# EAGLE schematic unipolar (EAGLE 8.2.2)
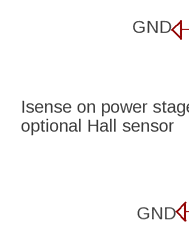
[diagram p0: schematic, sheet 1, part 1 of 2]
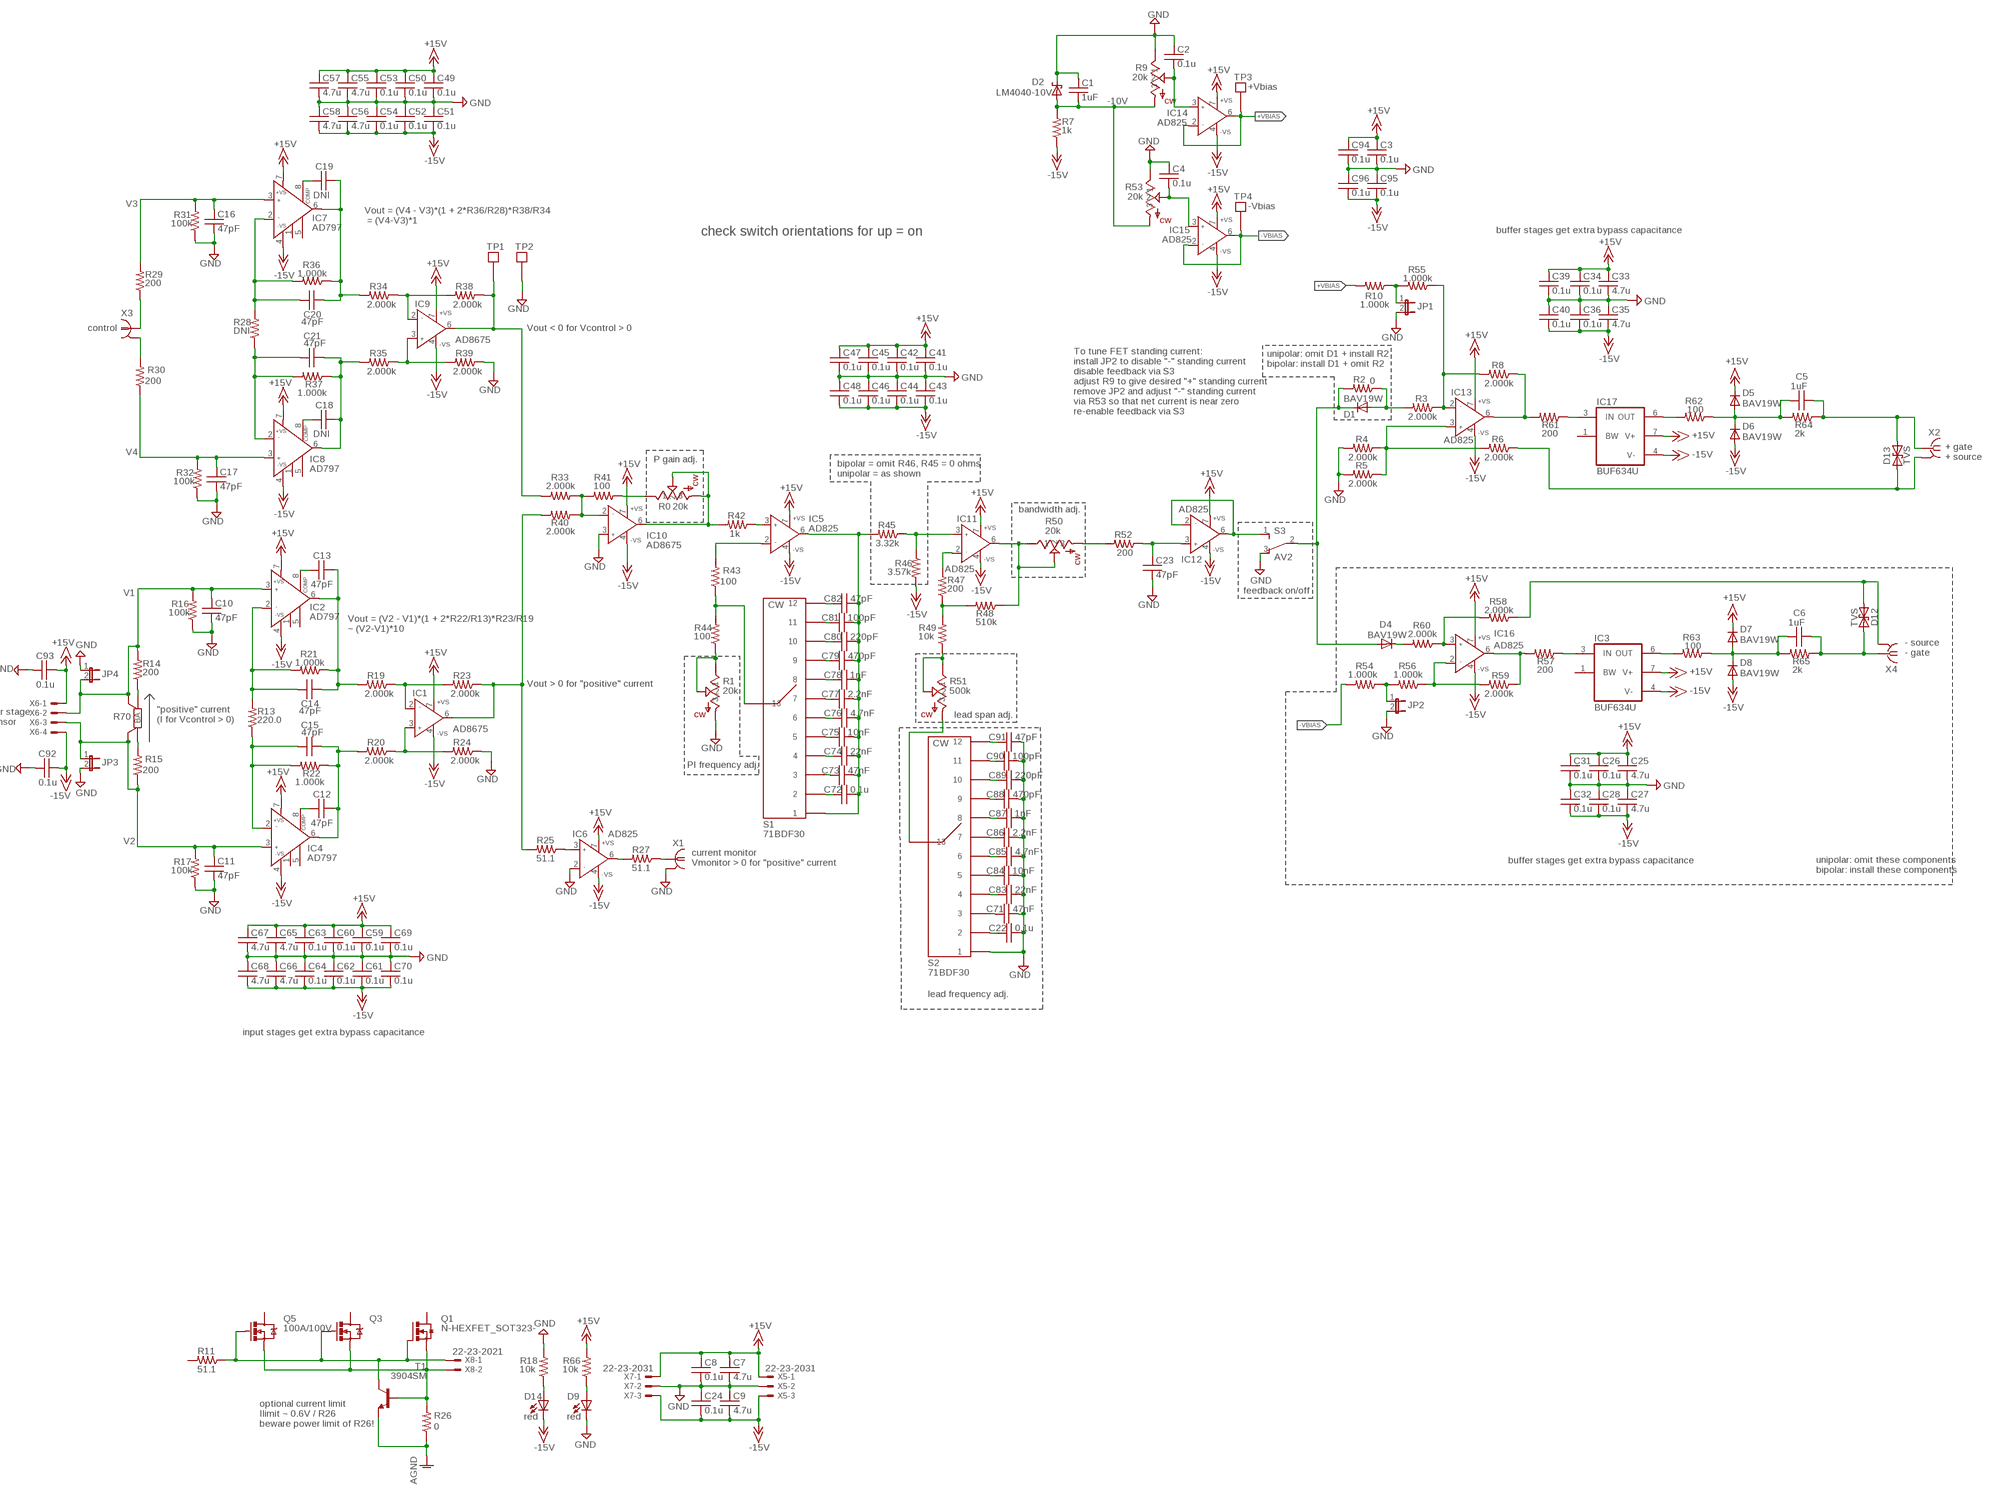
[diagram p1: schematic, sheet 1, part 2 of 2]

## Parts
C1  1uF  C0603  [0603]
C2  0.1u  C0603  [0603]
C3  0.1u  C0603  [0603]
C4  0.1u  C0603  [0603]
C5  1uF  C0603  [0603]
C6  1uF  C0603  [0603]
C7  4.7u  C0603  [0603]
C8  0.1u  C0603  [0603]
C9  4.7u  C0603  [0603]
C10  47pF  C0603  [0603]
C11  47pF  C0603  [0603]
C12  47pF  C0603  [0603]
C13  47pF  C0603  [0603]
C14  47pF  C0603  [0603]
C15  47pF  C0603  [0603]
C16  47pF  C0603  [0603]
C17  47pF  C0603  [0603]
C18  DNI  C0603  [0603]
C19  DNI  C0603  [0603]
C20  47pF  C0603  [0603]
C21  47pF  C0603  [0603]
C22  0.1u  C0603  [0603]
C23  47pF  C0603  [0603]
C24  0.1u  C0603  [0603]
C25  4.7u  C0603  [0603]
C26  0.1u  C0603  [0603]
C27  4.7u  C0603  [0603]
C28  0.1u  C0603  [0603]
C31  0.1u  C0603  [0603]
C32  0.1u  C0603  [0603]
C33  4.7u  C0603  [0603]
C34  0.1u  C0603  [0603]
C35  4.7u  C0603  [0603]
C36  0.1u  C0603  [0603]
C39  0.1u  C0603  [0603]
C40  0.1u  C0603  [0603]
C41  0.1u  C0603  [0603]
C42  0.1u  C0603  [0603]
C43  0.1u  C0603  [0603]
C44  0.1u  C0603  [0603]
C45  0.1u  C0603  [0603]
C46  0.1u  C0603  [0603]
C47  0.1u  C0603  [0603]
C48  0.1u  C0603  [0603]
C49  0.1u  C0603  [0603]
C50  0.1u  C0603  [0603]
C51  0.1u  C0603  [0603]
C52  0.1u  C0603  [0603]
C53  0.1u  C0603  [0603]
C54  0.1u  C0603  [0603]
C55  4.7u  C0603  [0603]
C56  4.7u  C0603  [0603]
C57  4.7u  C0603  [0603]
C58  4.7u  C0603  [0603]
C59  0.1u  C0603  [0603]
C60  0.1u  C0603  [0603]
C61  0.1u  C0603  [0603]
C62  0.1u  C0603  [0603]
C63  0.1u  C0603  [0603]
C64  0.1u  C0603  [0603]
C65  4.7u  C0603  [0603]
C66  4.7u  C0603  [0603]
C67  4.7u  C0603  [0603]
C68  4.7u  C0603  [0603]
C69  0.1u  C0603  [0603]
C70  0.1u  C0603  [0603]
C71  47nF  C0603  [0603]
C72  0.1u  C0603  [0603]
C73  47nF  C0603  [0603]
C74  22nF  C0603  [0603]
C75  10nF  C0603  [0603]
C76  4.7nF  C0603  [0603]
C77  2.2nF  C0603  [0603]
C78  1nF  C0603  [0603]
C79  470pF  C0603  [0603]
C80  220pF  C0603  [0603]
C81  100pF  C0603  [0603]
C82  47pF  C0603  [0603]
C83  22nF  C0603  [0603]
C84  10nF  C0603  [0603]
C85  4.7nF  C0603  [0603]
C86  2.2nF  C0603  [0603]
C87  1nF  C0603  [0603]
C88  470pF  C0603  [0603]
C89  220pF  C0603  [0603]
C90  100pF  C0603  [0603]
C91  47pF  C0603  [0603]
C92  0.1u  C0603  [0603]
C93  0.1u  C0603  [0603]
C94  0.1u  C0603  [0603]
C95  0.1u  C0603  [0603]
C96  0.1u  C0603  [0603]
D1  BAV19W  DIODE-SOD123  [SOD123]
D2  LM4040-10V  LM4040  [SOT23]
D4  BAV19W  DIODE-SOD123  [SOD123]
D5  BAV19W  DIODE-SOD123  [SOD123]
D6  BAV19W  DIODE-SOD123  [SOD123]
D7  BAV19W  DIODE-SOD123  [SOD123]
D8  BAV19W  DIODE-SOD123  [SOD123]
D9  red  LED0603  [LED0603]
D12  TVS  [SMA-DIODE]
D13  TVS  [SMA-DIODE]
D14  red  LED0603  [LED0603]
IC1  AD8675  AD825_BR  [SO8]
IC2  AD797  AD797_AR  [SO8]
IC3  BUF634U  [SO08]
IC4  AD797  AD797_BR  [SO8]
IC5  AD825  AD825_A  [SO08]
IC6  AD825  AD825_A  [SO08]
IC7  AD797  AD797_AR  [SO8]
IC8  AD797  AD797_BR  [SO8]
IC9  AD8675  AD825_BR  [SO8]
IC10  AD8675  AD825_BR  [SO8]
IC11  AD825  AD825_A  [SO08]
IC12  AD825  AD825_BR  [SO8]
IC13  AD825  AD825_BR  [SO8]
IC14  AD825  AD825_A  [SO08]
IC15  AD825  AD825_A  [SO08]
IC16  AD825  AD825_A  [SO08]
IC17  BUF634U  [SO08]
JP1  JP1E  [JP1]
JP2  JP1E  [JP1]
JP3  JP1E  [JP1]
JP4  JP1E  [JP1]
Q1  N-HEXFET_SOT323-  [SOT223]
Q3  MOSFET-NCHANNELFDD8780  [DPAK]
Q5  100A/100V  MOSFET-NCHANNELPSMN7R0  [TO-263/D2PAK]
R0  20k  POT  [3590]
R1  20k  TRIM_US-B90P  [SP19L]
R2  0  R0603  [0603]
R3  2.000k  R0603  [0603]
R4  2.000k  R0603  [0603]
R5  2.000k  R0603  [0603]
R6  2.000k  R0603  [0603]
R7  1k  R0603  [0603]
R8  2.000k  R0603  [0603]
R9  20k  TRIM_US-B90P  [SP19L]
R10  1.000k  R0603  [0603]
R11  51.1  R0603  [0603]
R13  220.0  R0603  [0603]
R14  200  R0603  [0603]
R15  200  R0603  [0603]
R16  100k  R0603  [0603]
R17  100k  R0603  [0603]
R18  10k  R0603  [0603]
R19  2.000k  R0603  [0603]
R20  2.000k  R0603  [0603]
R21  1.000k  R0603  [0603]
R22  1.000k  R0603  [0603]
R23  2.000k  R0603  [0603]
R24  2.000k  R0603  [0603]
R25  51.1  R0603  [0603]
R26  0  RESISTOR2512  [2512]
R27  51.1  R0603  [0603]
R28  DNI  R0603  [0603]
R29  200  R0603  [0603]
R30  200  R0603  [0603]
R31  100k  R0603  [0603]
R32  100k  R0603  [0603]
R33  2.000k  R0603  [0603]
R34  2.000k  R0603  [0603]
R35  2.000k  R0603  [0603]
R36  1.000k  R0603  [0603]
R37  1.000k  R0603  [0603]
R38  2.000k  R0603  [0603]
R39  2.000k  R0603  [0603]
R40  2.000k  R0603  [0603]
R41  100  R0603  [0603]
R42  1k  R0603  [0603]
R43  100  R0603  [0603]
R44  100  R0603  [0603]
R45  3.32k  R0603  [0603]
R46  3.57k  R0603  [0603]
R47  200  R0603  [0603]
R48  510k  R0603  [0603]
R49  10k  R0603  [0603]
R50  20k  TRIM_US-B90P  [SP19L]
R51  500k  TRIM_US-B90P  [SP19L]
R52  200  R0603  [0603]
R53  20k  TRIM_US-B90P  [SP19L]
R54  1.000k  R0603  [0603]
R55  1.000k  R0603  [0603]
R56  1.000k  R0603  [0603]
R57  200  R0603  [0603]
R58  2.000k  R0603  [0603]
R59  2.000k  R0603  [0603]
R60  2.000k  R0603  [0603]
R61  200  R0603  [0603]
R62  100  R0603  [0603]
R63  100  R0603  [0603]
R64  2k  R0603  [0603]
R65  2k  R0603  [0603]
R66  10k  R0603  [0603]
R70  RSENSE  [22-23-2041]
S1  71BDF30  [71BDF]
S2  71BDF30  [71BDF]
S3  AV2  SPDT  [SPDT-AV2]
T1  3904SM  [SOT23]
TP1  TESTPOINT  [TESTPOINT]
TP2  TESTPOINT  [TESTPOINT]
TP3  TESTPOINT  [TESTPOINT]
TP4  TESTPOINT  [TESTPOINT]
X1  1-227161-0  [AMP_227161]
X2  BU-SMA-H  [BU-SMA-H]
X3  1-227161-0  [AMP_227161]
X4  BU-SMA-H  [BU-SMA-H]
X5  22-23-2031  [22-23-2031]
X6  22-23-2041  [22-23-2041]
X7  22-23-2031  [22-23-2031]
X8  22-23-2021  [22-23-2021]

## Nets
+15V: C3.1 C7.1 C8.1 C25.1 C26.1 C31.1 C33.1 C34.1 C39.1 C41.1 C42.1 C45.1 C47.1 C49.1 C50.1 C53.1 C55.1 C57.1 C59.1 C60.1 C63.1 C65.1 C67.1 C69.1 C93.2 C94.1 D5.C D7.C IC1.7(+VS) IC2.7(+VS) IC3.7(V+) IC4.7(+VS) IC5.7(+VS) IC6.7(+VS) IC7.7(+VS) IC8.7(+VS) IC9.7(+VS) IC10.7(+VS) IC11.7(+VS) IC12.7(+VS) IC13.7(+VS) IC14.7(+VS) IC15.7(+VS) IC16.7(+VS) IC17.7(V+) R66.2 X5.1 X6.1 X7.1
+GATE: C5.2 D13.C R64.1 X2.1
+SOURCE: D13.A R6.1 X2.2 X2.3 X2.4 X2.5
+VBIAS: IC14.2(IN-) IC14.6(OUT) R10.2 TP3.P$1
-10V: C1.2 D2.2(A) R7.2 R9.E R53.E
-15V: C9.2 C24.2 C27.2 C28.2 C32.2 C35.2 C36.2 C40.2 C43.2 C44.2 C46.2 C48.2 C51.2 C52.2 C54.2 C56.2 C58.2 C61.2 C62.2 C64.2 C66.2 C68.2 C70.2 C92.2 C95.2 C96.2 D6.A D8.A D14.C IC1.4(-VS) IC2.4(-VS) IC3.4(V-) IC4.4(-VS) IC5.4(-VS) IC6.4(-VS) IC7.4(-VS) IC8.4(-VS) IC9.4(-VS) IC10.4(-VS) IC11.4(-VS) IC12.4(-VS) IC13.4(-VS) IC14.4(-VS) IC15.4(-VS) IC16.4(-VS) IC17.4(V-) R7.1 R46.2 X5.3 X6.4 X7.3
-GATE: C6.2 D12.C R65.1 X4.1
-SOURCE: D12.A R58.1 X4.2 X4.3 X4.4 X4.5
-VBIAS: IC15.2(IN-) IC15.6(OUT) R54.2 TP4.P$1
AGND: R26.1 T1.2(E)
GND: C1.1 C2.1 C3.2 C4.1 C7.2 C8.2 C9.1 C10.2 C11.2 C16.2 C17.2 C22.2 C23.2 C24.1 C25.2 C26.2 C27.1 C28.1 C31.2 C32.1 C33.2 C34.2 C35.1 C36.1 C39.2 C40.1 C41.2 C42.2 C43.1 C44.1 C45.2 C46.1 C47.2 C48.1 C49.2 C50.2 C51.1 C52.1 C53.2 C54.1 C55.2 C56.1 C57.2 C58.1 C59.2 C60.2 C61.1 C62.1 C63.2 C64.1 C65.2 C66.1 C67.2 C68.1 C69.2 C70.1 C71.2 C83.2 C84.2 C85.2 C86.2 C87.2 C88.2 C89.2 C90.2 C91.2 C92.1 C93.1 C94.2 C95.1 C96.1 D2.1(C) D9.C IC6.2(IN-) IC10.3(IN+) JP1.2 JP2.2 JP3.2 JP4.1 R1.E R4.2 R5.2 R9.A R16.1 R17.1 R18.2 R24.1 R31.1 R32.1 R39.1 R53.A S2.1 S3.3 TP2.P$1 X1.2 X5.2 X7.2
N$1: R1.A R1.S R44.1
N$2: D1.A R2.1 R3.2
N$3: JP1.1 R10.1 R55.2
N$4: D4.C R60.2
N$5: IC13.3(IN+) R4.1 R5.1 R6.2
N$6: Q1.1(G) Q3.1(G) Q5.1(G) R11.1 T1.3(C) X8.1
N$7: C14.1 IC2.2(IN-) R13.2 R21.2
N$8: R14.1 R70.1(A)
N$9: IC13.2(IN-) R3.1 R8.2 R55.1
N$10: Q1.3(S) Q3.3(S) Q5.3(S) R26.2 T1.1(B) X8.2
N$12: C2.2 IC14.3(IN+) R9.S
N$13: R15.2 R70.4(B)
N$15: C15.1 IC4.2(IN-) R13.1 R22.2
N$16: C12.1 IC4.8(COMP)
N$17: C12.2 C15.2 IC4.6(OUT) R20.2 R22.1
N$18: C13.1 IC2.8(COMP)
N$19: C13.2 C14.2 IC2.6(OUT) R19.2 R21.1
N$20: IC1.2(IN-) R19.1 R23.2
N$21: IC1.3(IN+) R20.1 R24.2
N$22: IC1.6(OUT) R23.1 R25.2 R40.2
N$23: IC6.3(IN+) R25.1
N$24: IC6.6(OUT) R27.2
N$25: R27.1 X1.1
N$26: C20.1 IC7.2(IN-) R28.2 R36.2
N$27: C16.1 IC7.3(IN+) R29.2 R31.2
N$28: C17.1 IC8.3(IN+) R30.1 R32.2
N$29: R29.1 X3.1
N$30: R30.2 X3.2
N$31: C21.1 IC8.2(IN-) R28.1 R37.2
N$32: C18.1 IC8.8(COMP)
N$33: C18.2 C21.2 IC8.6(OUT) R35.2 R37.1
N$34: C19.1 IC7.8(COMP)
N$35: C19.2 C20.2 IC7.6(OUT) R34.2 R36.1
N$36: IC9.2(IN-) R34.1 R38.2
N$37: IC9.3(IN+) R35.1 R39.2
N$38: IC9.6(OUT) R33.2 R38.1 TP1.P$1
N$39: IC10.2(IN-) R33.1 R40.1 R41.2
N$40: IC11.3(IN+) R45.1 R46.1
N$41: IC10.6(OUT) R0.2 R0.3 R42.2
N$42: IC5.3(IN+) R42.1
N$43: IC5.2(IN-) R43.2
N$44: R43.1 R44.2 S1.13
N$45: R51.E S2.13
N$46: IC11.2(IN-) R47.2
N$47: R47.1 R48.2 R49.2
N$48: IC11.6(OUT) R48.1 R50.A R50.S
N$50: R49.1 R51.A R51.S
N$51: R50.E R52.2
N$52: C23.1 IC12.3(IN+) R52.1
N$53: IC12.2(IN-) IC12.6(OUT) S3.1
N$54: D1.C D4.A R2.2 S3.2
N$57: C4.2 IC15.3(IN+) R53.S
N$59: JP2.1 R54.1 R56.2
N$60: IC16.2(IN-) R56.1 R59.2
N$61: IC16.3(IN+) R58.2 R60.1
N$62: IC16.6(OUT) R57.2 R59.1
N$63: D9.A R66.1
N$64: IC3.3(IN) R57.1
N$65: IC17.3(IN) R61.1
N$66: IC13.6(OUT) R8.1 R61.2
N$68: IC17.6(OUT) R62.2
N$69: IC3.6(OUT) R63.2
N$70: C5.1 D5.A D6.C R62.1 R64.2
N$73: C6.1 D7.A D8.C R63.1 R65.2
N$77: D14.A R18.1
N$78: C72.2 C73.2 C74.2 C75.2 C76.2 C77.2 C78.2 C79.2 C80.2 C81.2 C82.2 IC5.6(OUT) R45.2 S1.1
N$79: C72.1 S1.2
N$80: C73.1 S1.3
N$81: C74.1 S1.4
N$82: R0.1 R41.1
N$83: C75.1 S1.5
N$84: C76.1 S1.6
N$85: C77.1 S1.7
N$86: C78.1 S1.8
N$87: C79.1 S1.9
N$88: C80.1 S1.10
N$89: C81.1 S1.11
N$90: C82.1 S1.12
N$91: C22.1 S2.2
N$92: C71.1 S2.3
N$93: C83.1 S2.4
N$94: C84.1 S2.5
N$95: C85.1 S2.6
N$96: C86.1 S2.7
N$97: C87.1 S2.8
N$98: C88.1 S2.9
N$99: C89.1 S2.10
N$100: C90.1 S2.11
N$101: C91.1 S2.12
V+: C11.1 IC4.3(IN+) JP3.1 R15.1 R17.2 R70.3(SB) X6.3
V-: C10.1 IC2.3(IN+) JP4.2 R14.2 R16.2 R70.2(SA) X6.2
Unconnected: IC2.1(OFF) IC2.5(OFF) IC3.1(BW) IC4.1(OFF) IC4.5(OFF) IC7.1(OFF) IC7.5(OFF) IC8.1(OFF) IC8.5(OFF) IC17.1(BW) Q1.4(D) Q3.4(D) Q5.2(D) R11.2

## Notes on the sheet
- +Vbias
- -10V
- V3 | -Vbias
- Vout = (V4 - V3)*(1 + 2*R36/R28)*R38/R34 
   = (V4-V3)*1
- check switch orientations for up = on | buffer stages get extra bypass capacitance
- control | Vout < 0 for Vcontrol > 0
- unipolar: omit D1 + install R2
  bipolar: install D1 + omit R2
- To tune FET standing current:
  install JP2 to disable "-" standing current
  disable feedback via S3
  adjust R9 to give desired "+" standing current
  remove JP2 and adjust "-" standing current 
  via R53 so that net current is near zero
  re-enable feedback via S3
- V4
- + gate
  + source
- P gain adj.
- bipolar = omit R46, R45 = 0 ohms
  unipolar = as shown
- bandwidth adj.
- V1 | feedback on/off
- Vout = (V2 - V1)*(1 + 2*R22/R13)*R23/R19 
  ~ (V2-V1)*10
- - source
  - gate
- Vout > 0 for "positive" current
- lead span adj.
- "positive" current 
  (I for Vcontrol > 0)
- Isense on power stage
  optional Hall sensor
- PI frequency adj.
- V2
- buffer stages get extra bypass capacitance
- current monitor
  Vmonitor > 0 for "positive" current
- unipolar: omit these components
  bipolar: install these components
- lead frequency adj.
- input stages get extra bypass capacitance
- optional current limit
  Ilimit ~ 0.6V / R26
  beware power limit of R26!

## Library data of the parts
C1-C28 C31-C36 C39-C96 = acrooptics:C: Capacitor
D1 D4-D8 = AquariumLibrary:DIODE-: DIODE
D2 = noah:LM4040: LM4040 Reference Zener Diode
D9 D14 = acrooptics:LED: LED OSRAM: - CHIPLED LG R971, LG N971, LY N971, LG Q971, LY Q971, LO R971, LY R971 LH N974, LH R974 LS Q976, LO Q976, LY Q976 LO Q996 - Hyper CHIPLED LW Q18S LB Q993, LB Q99A, LB R99A - SideLED LS A670, LO A670, LY A670, LG A670, LP A670 LB A673, LV A673, LT A673, LW A673 LH A674 LY A675 LS A676, LA A676, LO A676, LY A676, LW A676 LS A679, LY A679, LG A679 - Hyper Micro SIDELED® LS Y876, LA Y876, LO Y876, LY Y876 LT Y87S - SmartLED LW L88C, LW L88S LB L89C, LB L89S, LG L890 LS L89K, LO L89K, LY L89K LS L896, LA L896, LO L896, LY L896 - TOPLED LS T670, LO T670, LY T670, LG T670, LP T670 LSG T670, LSP T670, LSY T670, LOP T670, LYG T670 LG T671, LOG T671, LSG T671 LB T673, LV T673, LT T673, LW T673 LH T674 LS T676, LA T676, LO T676, LY T676, LB T676, LH T676, LSB T676, LW T676 LB T67C, LV T67C, LT T67C, LS T67K, LO T67K, LY T67K, LW E67C LS E67B, LA E67B, LO E67B, LY E67B, LB E67C, LV E67C, LT E67C LW T67C LS T679, LY T679, LG T679 LS T770, LO T770, LY T770, LG T770, LP T770 LB T773, LV T773, LT T773, LW T773 LH T774 LS E675, LA E675, LY E675, LS T675 LS T776, LA T776, LO T776, LY T776, LB T776 LHGB T686 LT T68C, LB T68C - Hyper Mini TOPLED® LB M676 - Mini TOPLED Santana® LG M470 LS M47K, LO M47K, LY M47K Source: http://www.osram.convergy.de LUXEON: - LUMILED® LXK2-PW12-R00, LXK2-PW12-S00, LXK2-PW14-U00, LXK2-PW14-V00 LXK2-PM12-R00, LXK2-PM12-S00, LXK2-PM14-U00 LXK2-PE12-Q00, LXK2-PE12-R00, LXK2-PE12-S00, LXK2-PE14-T00, LXK2-PE14-U00 LXK2-PB12-K00, LXK2-PB12-L00, LXK2-PB12-M00, LXK2-PB14-N00, LXK2-PB14-P00, LXK2-PB14-Q00 LXK2-PR12-L00, LXK2-PR12-M00, LXK2-PR14-Q00, LXK2-PR14-R00 LXK2-PD12-Q00, LXK2-PD12-R00, LXK2-PD12-S00 LXK2-PH12-R00, LXK2-PH12-S00 LXK2-PL12-P00, LXK2-PL12-Q00, LXK2-PL12-R00 Source: www.luxeon.com KINGBRIGHT: KA-3528ASYC Source: www.kingbright.com
D12 D13 = SparkFun:TVS
IC1 IC9 IC10 IC12 IC13 = noah:AD825_B: Low Cost, General-Purpose High Speed JFET Amplifier Source: http://www.analog.com/static/imported-files/data_sheets/AD825.pdf; MF: ALTERA CORPORATION; MPN: AD825ARZ; OC_FARNELL: 9603735; OC_NEWARK: 59K6528
IC2 IC7 = noah:AD797_A: Ultralow Distortion, Ultralow Noise Op Amp Source: http://www.analog.com/static/imported-files/data_sheets/AD797.pdf; MF: ALTERA CORPORATION; MPN: AD797ARZ; OC_FARNELL: 9426450; OC_NEWARK: 88H0085
IC3 IC17 = burr-brown:BUF634: 250mA High-Speed Buffer; MF: TEXAS INSTRUMENTS; MPN: BUF634U; OC_FARNELL: 4733617; OC_NEWARK: 27C6567
IC4 IC8 = noah:AD797_B: Ultralow Distortion, Ultralow Noise Op Amp Source: http://www.analog.com/static/imported-files/data_sheets/AD797.pdf; MF: ALTERA CORPORATION; MPN: AD797ARZ; OC_FARNELL: 9426450; OC_NEWARK: 88H0085
IC5 IC6 IC11 IC14-IC16 = noah:AD825_A: Low Cost, General-Purpose High Speed JFET Amplifier Source: http://www.analog.com/static/imported-files/data_sheets/AD825.pdf
JP1-JP4 = jumper:JP1E: JUMPER
Q1 = transistor-power:N-HEXFET_?-*: HEXFET® Power MOSFET
Q3 = WCSMain:MOSFET-NCHANNEL: Common NMOSFET Parts MFG P/N Store ID Prod ID FDD8780 TRANS-09984 SI7820DN TRANS-11055 FDS6630A IC-08089 2N7002PW TRANS-11151 FQP30N06L COM-10213 TRANS-10060 BSS123LT1G TRANS-08345 BSS138 TRANS-00830 BS170 2N7000; PROD_ID: TRANS-09984
Q5 = WCSMain:MOSFET-NCHANNEL: Common NMOSFET Parts MFG P/N Store ID Prod ID FDD8780 TRANS-09984 SI7820DN TRANS-11055 FDS6630A IC-08089 2N7002PW TRANS-11151 FQP30N06L COM-10213 TRANS-10060 BSS123LT1G TRANS-08345 BSS138 TRANS-00830 BS170 2N7000; PROD_ID: TRANS-12437
R0 = Fitch:POT
R1 R9 R50 R51 R53 = Fitch:TRIM_US-: POTENTIOMETER
R2-R8 R10 R11 R13-R25 R27-R49 R52 R54-R66 = acrooptics:R: 0603 resistor
R26 = noah:RESISTOR: RESISTOR, American symbol
R70 = noah:RSENSE: SMD SHUNT RESISTOR
S1 S2 = noah:71BDF30: Grayhill 71 series rotary switch, BD style. DK part number GH7107
S3 = noah:SPDT
T1 = noah:3904: NPN TRANSISTOR
TP1-TP4 = Fitch:TESTPOINT
X1 X3 = con-coax:?227161*: JACK, RIGHT ANGLE, 50 OHM, PCB, BNC Source: amp_227161.pdf; MF: TYCO ELECTRONICS; MPN: 1-227161; OC_FARNELL: unknown; OC_NEWARK: 33B3200
X2 X4 = con-coax:BU-SMA-H: FEMALE SMA CONNECTOR Radiall; OC_FARNELL: unknown; OC_NEWARK: unknown
X5 X7 = con-molex:22-23-2031: .100" (2.54mm) Center Header - 3 Pin; MF: MOLEX; MPN: 22-23-2031; OC_FARNELL: 1462950; OC_NEWARK: 30C0862
X6 = con-molex:22-23-2041: .100" (2.54mm) Center Header - 4 Pin; MF: MOLEX; MPN: 22-23-2041; OC_FARNELL: 1462920; OC_NEWARK: 38C0355
X8 = con-molex:22-23-2021: .100" (2.54mm) Center Header - 2 Pin; MF: MOLEX; MPN: 22-23-2021; OC_FARNELL: 1462926; OC_NEWARK: 25C3832

## Net classes
1 standard: width 0.61 mm, clearance 0.254 mm